# EAGLE board bontor_mbed_lowpan_rev_g (EAGLE 6.3), part 1 of 2
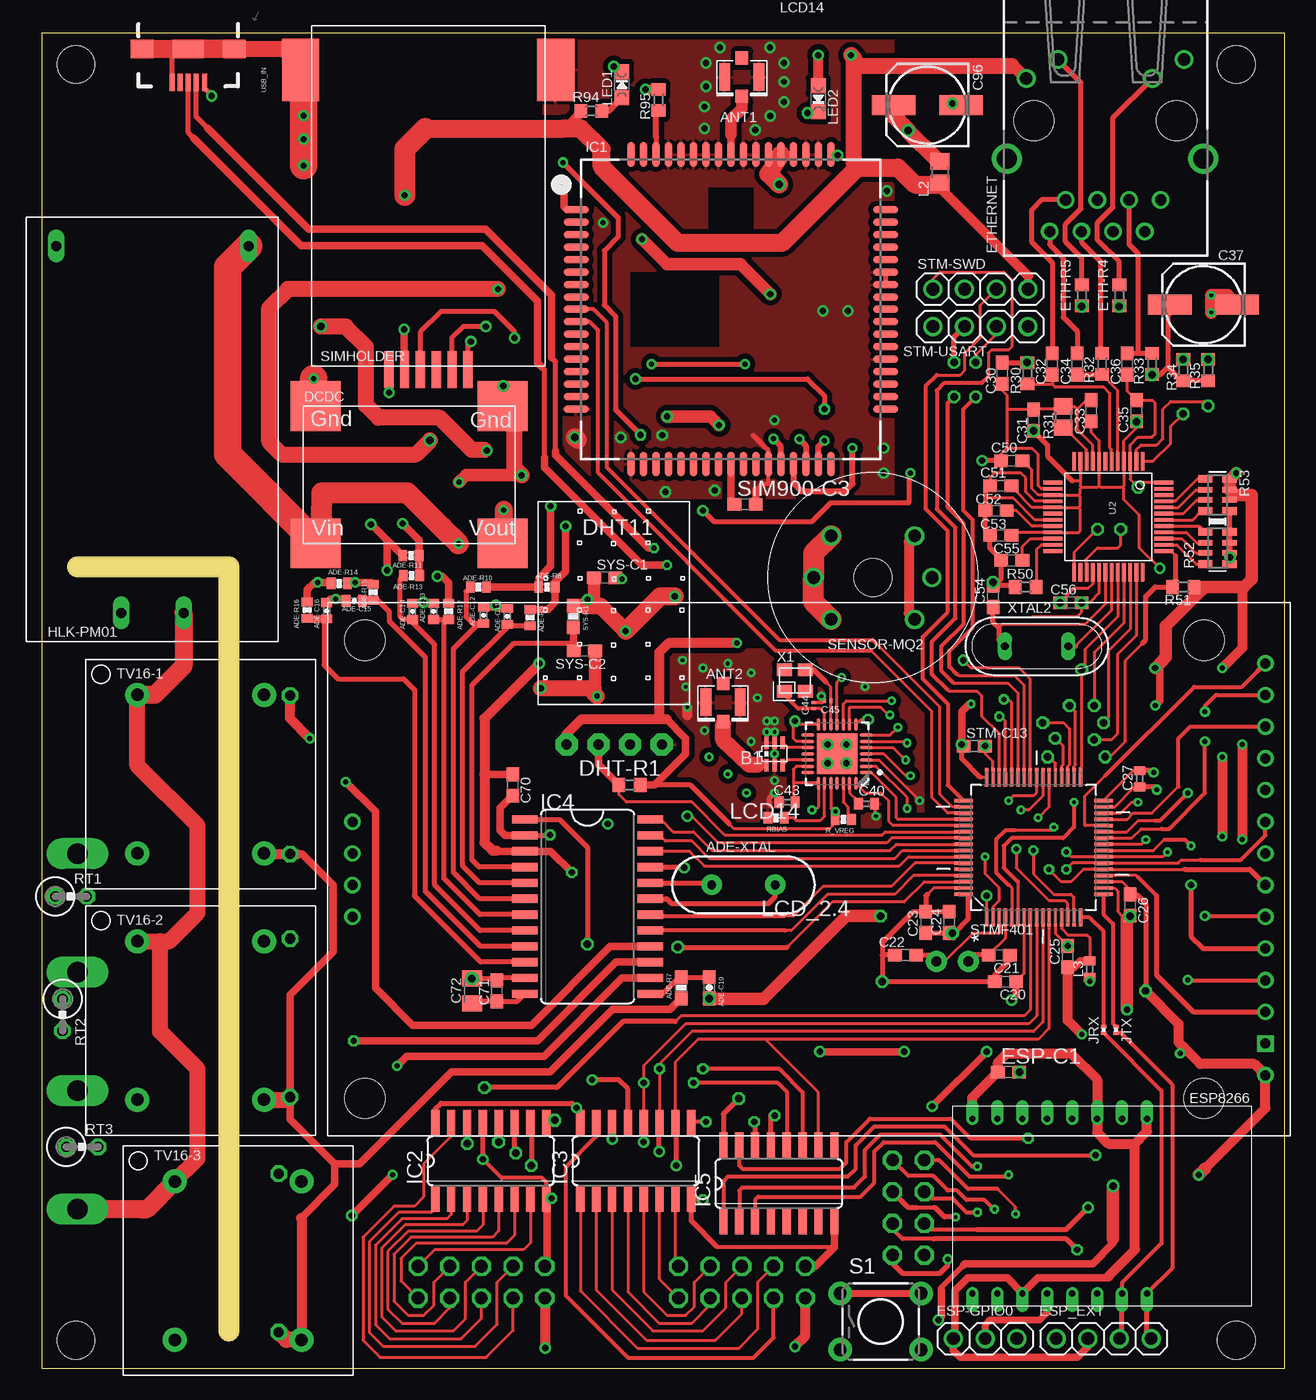
[diagram p2: board, top side]
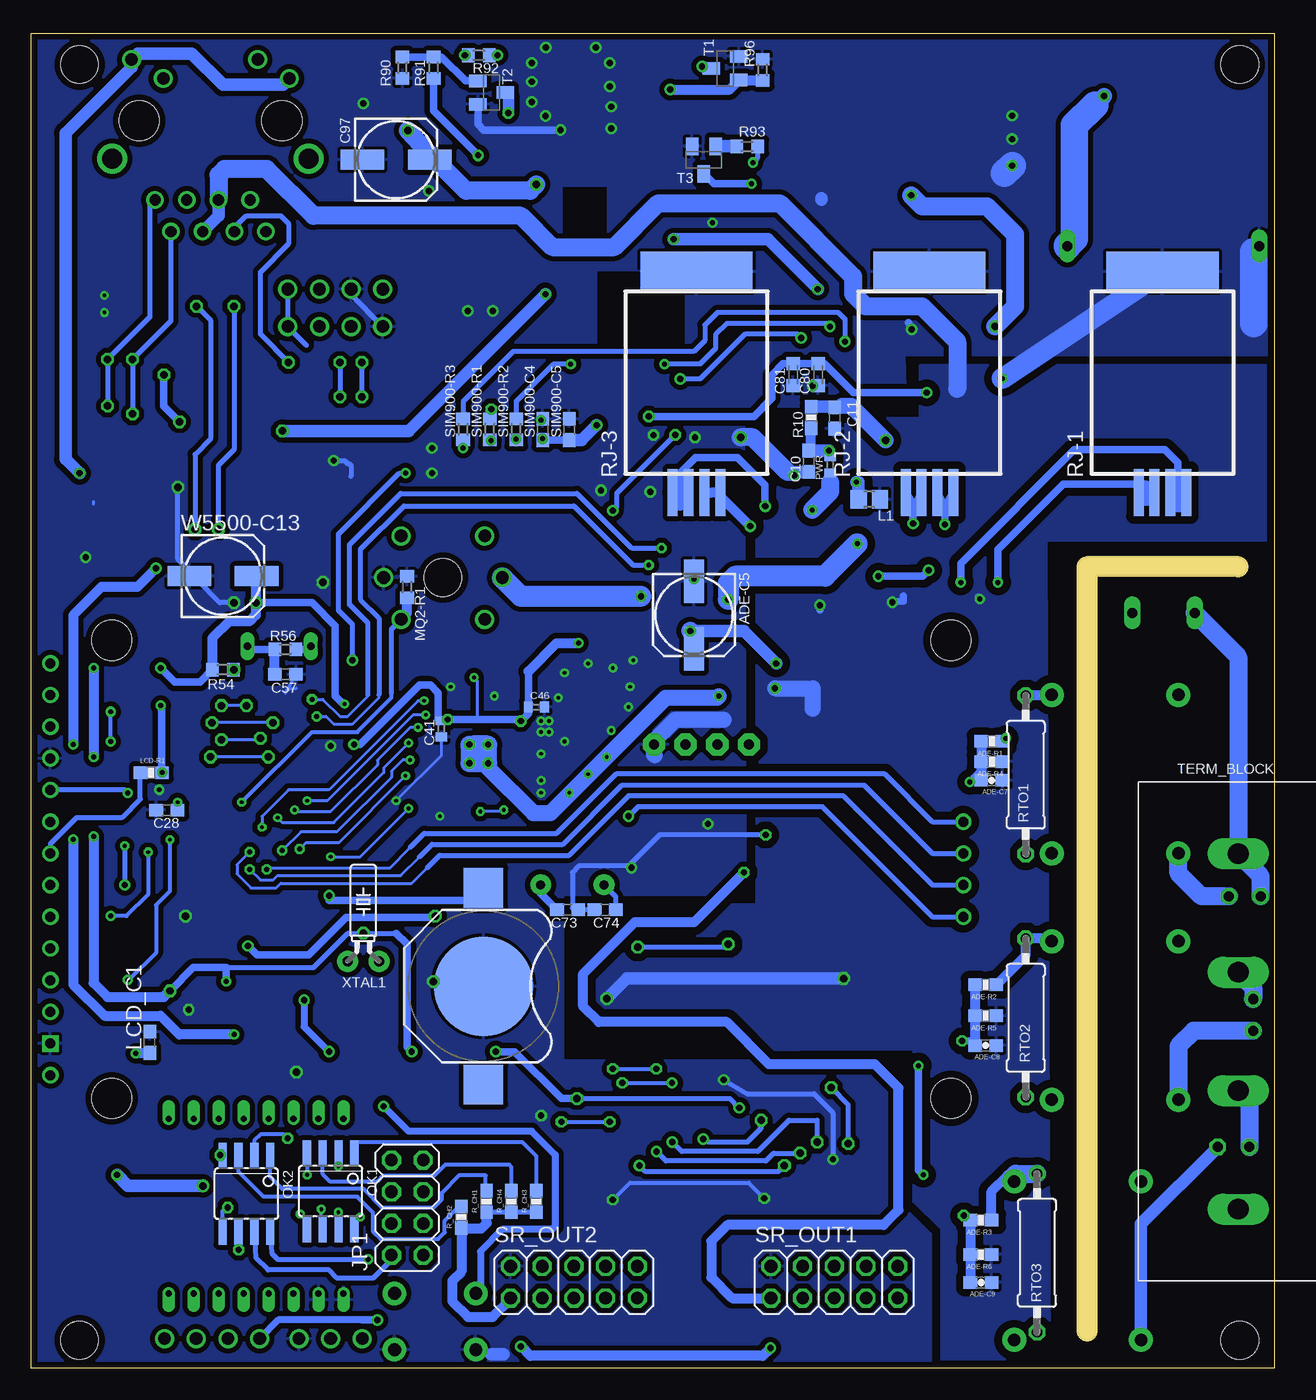
[diagram p3: board, bottom side, seen from below]

Size 99.62 x 107 mm. Coordinates in mm from the lower left corner, seen from the top.
Outline: 2.88,64.25 15,64.25 15,3
Outline: 99.62,0 99.62,107 0,107 0,0 99.62,0
Copper layers (1*16): Top 0.035mm / dielectric 1.5mm / Bottom 0.035mm
Design rules "default *": minimum track width 10mil, minimum drill 10mil, track to track 0.125mm, track to pad 0.125mm, pad to pad 0.125mm, via to via 0.125mm, smd to smd 0mil, copper to edge 0.5mm, drill to drill 0.2mm, minimum pad ring 10mil, minimum via ring 8mil, stop-mask expansion 4mil, vias tented up to drill 0mil, thermal gap 10mil
Net classes: 1 power: width 0.305 mm, drill 0.6 mm, clearance 0.254 mm; 2 gnd: width 0.254 mm, drill 0.6 mm, clearance 0.254 mm
Holes 3 mm at 2.75,2.25 95.75,2.25 2.75,104.5 95.75,104.5

## Footprints (pad centres in the part's own frame; a part is rotated, then mirrored left to right if it is on the bottom)
153CLV-0605 = smd 3.5 x 1.6: + 2.7,0; - -2.7,0
0603-CAP = smd 1.1 x 1: 1 -0.85,0; 2 0.85,0
0402-CAP = smd 0.7 x 0.9: 1 -0.65,0; 2 0.65,0
0603-RES = smd 1.1 x 1: 1 -0.85,0; 2 0.85,0
0402-RES = smd 0.7 x 0.9: 1 -0.65,0; 2 0.65,0
HC49US = drill 0.7 pad 1.651: 1 -2.54,0; 2 2.54,0
U.FL = smd 2.2 x 0.85: P$1 0,1.375; P$2 0,-1.375 | smd 1.05 x 1: P$3 1.525,0; P$4 -1.525,0
2450BM = smd 0.35 x 1: 1 0.65,0.9; 2 0,0.9; 3 -0.65,0.9; 4 -0.65,-0.9; 5 0,-0.9; 6 0.65,-0.9
BATTCON_12MM = smd 8 x 8: GND 0,0 | smd 3.175 x 3.175: PWR@1 -7.874,0; PWR@2 7.874,0
C0603 = smd 1.1 x 1: 1 -0.85,0; 2 0.85,0
C0402 = smd 0.7 x 0.9: 1 -0.65,0; 2 0.65,0
C0201 = smd 0.25 x 0.35: 1 -0.25,0; 2 0.25,0
C0805K = smd 1.3 x 1.6: 1 -1,0; 2 1,0
C0603K = smd 1.05 x 1.08: 1 -0.875,0; 2 0.875,0
DCDCMODULE-360 = smd 4 x 4: GND$1 -7.5,5.5; GND$2 7.5,5.5; VIN -7.5,-5.5; VOUT 7.5,-5.5
R0603 = smd 1 x 1.1: 1 -0.85,0; 2 0.85,0
WI12 = drill 0.5 pad 0.813 offset: ADC 10.4,1; CH_PD 12.4,1; GND 22.4,15; GPIO00 16.4,15; GPIO02 18.4,15; GPIO04 12.4,15; GPIO05 14.4,15; GPIO12 18.4,1; GPIO13 20.4,1; GPIO14 16.4,1; GPIO15 20.4,15; GPIO16 14.4,1; REST 8.4,1; RXD 10.4,15; TXD 8.4,15; VCC 22.4,1
1X03 = drill 1.016: 1 -2.54,0; 2 0,0; 3 2.54,0
PINHD4 = drill 1.016: 1 -3.81,0; 2 -1.27,0; 3 1.27,0; 4 3.81,0
RJ45_PULSEJACK = drill 0.9: 1 4.445,-6.35; 2 3.175,-8.89; 3 1.905,-6.35; 4 0.635,-8.89; 5 -0.635,-6.35; 6 -1.905,-8.89; 7 -3.175,-6.35; 8 -4.445,-8.89 | drill 1: 9 6.325,4.9; 10 3.785,3.38; 11 -3.785,4.9; 12 -6.325,3.38 | drill 1.6: P$5 -7.875,-3.05; P$6 7.875,-3.05 | hole 3.2: -5.715,0; 5.715,0
HLK-PM01 = drill 0.8 long: AC$1 -14.7,2.5; AC$2 -14.7,-2.5; GND 14.7,7.7; VOUT 14.7,-7.7
SIM900_SMT = smd 2 x 0.6: P$1 -12.4,8; P$2 -12.4,7; P$3 -12.4,6; P$4 -12.4,5; P$5 -12.4,4; P$6 -12.4,3; P$7 -12.4,2; P$8 -12.4,1; P$9 -12.4,0; P$10 -12.4,-1; P$11 -12.4,-2; P$12 -12.4,-3; P$13 -12.4,-4; P$14 -12.4,-5; P$15 -12.4,-6; P$16 -12.4,-7; P$17 -12.4,-8; P$35 12.4,-8; P$36 12.4,-7; P$37 12.4,-6; P$38 12.4,-5; P$39 12.4,-4; P$40 12.4,-3; P$41 12.4,-2; P$42 12.4,-1; P$43 12.4,0; P$44 12.4,1; P$45 12.4,2; P$46 12.4,3; P$47 12.4,4; P$48 12.4,5; P$49 12.4,6; P$50 12.4,7; P$51 12.4,8 | smd 0.6 x 2: P$18 -8,-12.4; P$19 -7,-12.4; P$20 -6,-12.4; P$21 -5,-12.4; P$22 -4,-12.4; P$23 -3,-12.4; P$24 -2,-12.4; P$25 -1,-12.4; P$26 0,-12.4; P$27 1,-12.4; P$28 2,-12.4; P$29 3,-12.4; P$30 4,-12.4; P$31 5,-12.4; P$32 6,-12.4; P$33 7,-12.4; P$34 8,-12.4; P$52 8,12.4; P$53 7,12.4; P$54 6,12.4; P$55 5,12.4; P$56 4,12.4; P$57 3,12.4; P$58 2,12.4; P$59 1,12.4; P$60 0,12.4; P$61 -1,12.4; P$62 -2,12.4; P$63 -3,12.4; P$64 -4,12.4; P$65 -5,12.4; P$66 -6,12.4; P$67 -7,12.4; P$68 -8,12.4
SO16 = smd 0.66 x 2.032: 1 -4.445,-3.073; 2 -3.175,-3.073; 3 -1.905,-3.073; 4 -0.635,-3.073; 5 0.635,-3.073; 6 1.905,-3.073; 7 3.175,-3.073; 8 4.445,-3.073; 9 4.445,3.073; 10 3.175,3.073; 11 1.905,3.073; 12 0.635,3.073; 13 -0.635,3.073; 14 -1.905,3.073; 15 -3.175,3.073; 16 -4.445,3.073
SOIC24 = smd 0.66 x 2.032: 1 -6.985,-5.029; 2 -5.715,-5.029; 3 -4.445,-5.029; 4 -3.175,-5.029; 5 -1.905,-5.029; 6 -0.635,-5.029; 7 0.635,-5.029; 8 1.905,-5.029; 9 3.175,-5.029; 10 4.445,-5.029; 11 5.715,-5.029; 12 6.985,-5.029; 13 6.985,5.029; 14 5.715,5.029; 15 4.445,5.029; 16 3.175,5.029; 17 1.905,5.029; 18 0.635,5.029; 19 -0.635,5.029; 20 -1.905,5.029; 21 -3.175,5.029; 22 -4.445,5.029; 23 -5.715,5.029; 24 -6.985,5.029
2X04 = drill 1.016 octagon: 1 -3.81,-1.27; 2 -3.81,1.27; 3 -1.27,-1.27; 4 -1.27,1.27; 5 1.27,-1.27; 6 1.27,1.27; 7 3.81,-1.27; 8 3.81,1.27
R0201 = smd 0.28 x 0.43: 1 -0.255,0; 2 0.255,0
FB805 = smd 1.3 x 1.5: 1 -0.85,0; 2 0.85,0
0402 = smd 0.7 x 0.9: 1 -0.65,0; 2 0.65,0
LCD_TOUCH_2-4 = drill 0.8: LCD_CS 36.59,-11.43; LCD_D/C 36.59,-6.35; LCD_MISO 36.59,3.81; LCD_MOSI 36.59,-3.81; LCD_RESET 36.59,-8.89; LCD_SCK 36.59,-1.27; LCD_VCC 36.59,-16.51; LED 36.59,1.27; SD_CS -36.59,-3.81; SD_MISO -36.59,1.27; SD_MOSI -36.59,-1.27; SD_SCK -36.59,3.81; T_CLK 36.59,6.35; T_CS 36.59,8.89; T_DIN 36.59,11.43; T_DO 36.59,13.97; T_IRQ 36.59,16.51 | drill 0.8 square: LCD_GND 36.59,-13.97 | hole 3.2: -35.59,18.36; -35.59,-18.36; 31.67,-18.36; 31.67,18.36
CHIPLED_0805_NOOUTLINE = smd 1.2 x 1.2: A 0,-1.05; C 0,1.05
SOIC08 = smd 0.66 x 2.032: 1 -1.905,-3.073; 2 -0.635,-3.073; 3 0.635,-3.073; 4 1.905,-3.073; 5 1.905,3.073; 6 0.635,3.073; 7 -0.635,3.073; 8 -1.905,3.073
R0402 = smd 0.7 x 0.9: 1 -0.65,0; 2 0.65,0
R0805 = smd 1.3 x 1.5: 1 -0.85,0; 2 0.85,0
RN8P-4R-CRA06S = smd 0.63 x 1.15: 1 -1.295,-0.975; 4 1.295,-0.975; 5 1.295,0.975; 8 -1.295,0.975 | smd 0.44 x 1.15: 2 -0.4,-0.975; 3 0.4,-0.975; 6 0.4,0.975; 7 -0.4,0.975
RJ11-4P-V = smd 0.8 x 3.8: P$1 -1.905,-8.81; P$2 -0.635,-8.81; P$3 0.635,-8.81; P$4 1.905,-8.81 | smd 9 x 3.2: SHIELD$1 0,8.9
0309V = drill 0.813 octagon: 1 -1.27,0; 2 1.27,0
0309_12 = drill 0.813 octagon: 1 -6.35,0; 2 6.35,0
TACTILE-PTH = drill 1.016 pad 1.88: 1 -3.251,2.261; 2 3.251,2.261; 3 -3.251,-2.261; 4 3.251,-2.261
MQ-3 = drill 1.016: A1 -3.35,3.35; A2 -3.35,-3.35; B1 3.35,3.35; B2 3.35,-3.35; HA -4.75,0; HB 4.75,0 | hole 3: 0,0
SIMHOLDER-PUSHPUSH = smd 3 x 5: SHIELD_GND$1 -10.24,9.2; SHIELD_GND$2 10.21,9.2 | smd 0.75 x 3: SIM_CLK 1.9,-14.83; SIM_GND -1.91,-14.83; SIM_IO 3.17,-14.83; SIM_RST -0.64,-14.83; SIM_VDD -3.18,-14.83; VPP 0.63,-14.83
2X05 = drill 1.016 octagon: 1 -5.08,-1.27; 2 -5.08,1.27; 3 -2.54,-1.27; 4 -2.54,1.27; 5 0,-1.27; 6 0,1.27; 7 2.54,-1.27; 8 2.54,1.27; 9 5.08,-1.27; 10 5.08,1.27
QFP50P1200X1200X160-64N = smd 1.473 x 0.279: 1 -5.613,3.759; 2 -5.613,3.251; 3 -5.613,2.743; 4 -5.613,2.261; 5 -5.613,1.753; 6 -5.613,1.245; 7 -5.613,0.762; 8 -5.613,0.254; 9 -5.613,-0.254; 10 -5.613,-0.762; 11 -5.613,-1.245; 12 -5.613,-1.753; 13 -5.613,-2.261; 14 -5.613,-2.743; 15 -5.613,-3.251; 16 -5.613,-3.759; 33 5.613,-3.759; 34 5.613,-3.251; 35 5.613,-2.743; 36 5.613,-2.261; 37 5.613,-1.753; 38 5.613,-1.245; 39 5.613,-0.762; 40 5.613,-0.254; 41 5.613,0.254; 42 5.613,0.762; 43 5.613,1.245; 44 5.613,1.753; 45 5.613,2.261; 46 5.613,2.743; 47 5.613,3.251; 48 5.613,3.759 | smd 0.279 x 1.473: 17 -3.759,-5.613; 18 -3.251,-5.613; 19 -2.743,-5.613; 20 -2.261,-5.613; 21 -1.753,-5.613; 22 -1.245,-5.613; 23 -0.762,-5.613; 24 -0.254,-5.613; 25 0.254,-5.613; 26 0.762,-5.613; 27 1.245,-5.613; 28 1.753,-5.613; 29 2.261,-5.613; 30 2.743,-5.613; 31 3.251,-5.613; 32 3.759,-5.613; 49 3.759,5.613; 50 3.251,5.613; 51 2.743,5.613; 52 2.261,5.613; 53 1.753,5.613; 54 1.245,5.613; 55 0.762,5.613; 56 0.254,5.613; 57 -0.254,5.613; 58 -0.762,5.613; 59 -1.245,5.613; 60 -1.753,5.613; 61 -2.261,5.613; 62 -2.743,5.613; 63 -3.251,5.613; 64 -3.759,5.613
SOT23-BEC = smd 1 x 1.4: B -0.95,-1.1; C 0,1.1; E 0.95,-1.1
TERMINAL-TWO-WAY = drill 1.65 long: PIN$1 0,14.25; PIN$2 0,4.75; PIN$3 0,-4.75; PIN$4 0,-14.25
TV16 = drill 1 pad 1.93: IA -5.08,-6.35; IB -5.08,6.35; OA 5.08,6.35; OB 5.08,-6.35
W5500 = smd 1.5 x 0.3: 1 -4.45,2.75; 2 -4.45,2.25; 3 -4.45,1.75; 4 -4.45,1.25; 5 -4.45,0.75; 6 -4.45,0.25; 7 -4.45,-0.25; 8 -4.45,-0.75; 9 -4.45,-1.25; 10 -4.45,-1.75; 11 -4.45,-2.25; 12 -4.45,-2.75; 25 4.45,-2.75; 26 4.45,-2.25; 27 4.45,-1.75; 28 4.45,-1.25; 29 4.45,-0.75; 30 4.45,-0.25; 31 4.45,0.25; 32 4.45,0.75; 33 4.45,1.25; 34 4.45,1.75; 35 4.45,2.25; 36 4.45,2.75 | smd 0.3 x 1.5: 13 -2.75,-4.45; 14 -2.25,-4.45; 15 -1.75,-4.45; 16 -1.25,-4.45; 17 -0.75,-4.45; 18 -0.25,-4.45; 19 0.25,-4.45; 20 0.75,-4.45; 21 1.25,-4.45; 22 1.75,-4.45; 23 2.25,-4.45; 24 2.75,-4.45; 37 2.75,4.45; 38 2.25,4.45; 39 1.75,4.45; 40 1.25,4.45; 41 0.75,4.45; 42 0.25,4.45; 43 -0.25,4.45; 44 -0.75,4.45; 45 -1.25,4.45; 46 -1.75,4.45; 47 -2.25,4.45; 48 -2.75,4.45
QFN50P500X500X100-29N = smd 1.05 x 0.3: 1 -2.35,1.5; 2 -2.35,1; 3 -2.35,0.5; 4 -2.35,0; 5 -2.35,-0.5; 6 -2.35,-1; 7 -2.35,-1.5; 15 2.35,-1.5; 16 2.35,-1; 17 2.35,-0.5; 18 2.35,0; 19 2.35,0.5; 20 2.35,1; 21 2.35,1.5 | smd 0.3 x 1.05: 8 -1.5,-2.35; 9 -1,-2.35; 10 -0.5,-2.35; 11 0,-2.35; 12 0.5,-2.35; 13 1,-2.35; 14 1.5,-2.35; 22 1.5,2.35; 23 1,2.35; 24 0.5,2.35; 25 0,2.35; 26 -0.5,2.35; 27 -1,2.35; 28 -1.5,2.35 | smd 3.25 x 3.25: 29 0,0
DHT11 = drill 0.8 pad 1.778 octagon: DATA -1.27,-11.43; GND 3.81,-11.43; NO 1.27,-11.43; VCC -3.81,-11.43
USB-B-MICRO-SMD_V03 = smd 1.4 x 0.4: D+1 2.7,0; D-1 2.7,0.65; GND1 2.7,-1.3; ID1 2.7,-0.65; VBUS1 2.7,1.3 | smd 1.5 x 1.8: SHIELD1 0,3.7; SHIELD2 0,-3.7 | smd 1.5 x 2.5: SHIELD3 0,0
NX2520SA = smd 1.2 x 1: 1 -0.85,-0.85; 2 0.85,-0.85; 3 0.85,0.85; 4 -0.85,0.85
TC26H = drill 0.813 pad 1.676: 1 -1.27,0; 2 1.27,0
QS = drill 0.61 long: 1 -2.54,0; 2 2.54,0

## Placement (x,y rotation side)
ADE-C5  10uF  [153CLV-0605]  46.5,60.38 270 bottom
ADE-C7  33nF  [0603-CAP]  22.62,47.12 0 bottom
ADE-C8  33nF  [0603-CAP]  23.12,25.88 0 bottom
ADE-C9  33nF  [0603-CAP]  23.5,6.88 0 bottom
ADE-C10  33nF  [0603-CAP]  53.5,30.5 270 top
ADE-C11  33nF  [0402-CAP]  37.33,60.27 90 top
ADE-C12  33nF  [0402-CAP]  35.42,60.38 90 top
ADE-C13  33nF  [0402-CAP]  31.43,60.67 90 top
ADE-C14  33nF  [0402-CAP]  29.73,60.67 90 top
ADE-C15  33nF  [0402-CAP]  25.05,61.52 180 top
ADE-C16  33nF  [0402-CAP]  22.85,60.73 90 top
ADE-R1  81K  [0603-RES]  22.62,50.25 180 bottom
ADE-R2  81K  [0603-RES]  23.12,30.75 180 bottom
ADE-R3  81K  [0603-RES]  23.5,11.88 180 bottom
ADE-R4  1K  [0603-RES]  22.62,48.62 180 bottom
ADE-R5  1K  [0603-RES]  23.12,28.25 180 bottom
ADE-R6  1K  [0603-RES]  23.5,9.12 180 bottom
ADE-R7  1K  [0603-RES]  51.25,30.5 90 top
ADE-R8  33R  [0402-RES]  40.5,62.62 0 top
ADE-R9  1K  [0402-RES]  39.15,60.17 270 top
ADE-R10  1K  [0402-RES]  35,62.62 180 top
ADE-R11  33R  [0402-RES]  29.6,65.15 180 top
ADE-R12  1K  [0402-RES]  32.62,60.67 270 top
ADE-R13  1K  [0402-RES]  29.65,63.55 180 top
ADE-R14  33R  [0402-RES]  23.85,62.91 0 top
ADE-R15  1K  [0402-RES]  26.57,62.2 270 top
ADE-R16  1K  [0402-RES]  21.27,60.76 270 top
ADE-XTAL  10MHz  [HC49US]  56.25,38.75 180 top
ANT1  U.FL  [U.FL]  56.12,103.5 270 top
ANT2  U.FL  [U.FL]  54.62,53.38 270 top
B1  2450BM15A0002  [2450BM]  58.75,49.25 180 top
BAT1  [BATTCON_12MM]  63.38,30.62 270 bottom
C10  0.1uF  [C0603]  37.31,72.7 270 bottom
C11  0.1uF  [C0603]  35.24,76.17 270 bottom
C20  100nF  [C0603]  77.25,31 180 top
C21  4.3pF  [C0603]  76.75,33.12 180 top
C22  4.3pF  [C0603]  69.25,33.12 0 top
C23  1uF  [C0603]  70.88,35.75 270 top
C24  100nF  [C0603]  72.75,35.75 90 top
C25  100nF  [C0603]  82.25,33 90 top
C26  100nF  [C0603]  87.25,37.12 270 top
C27  100nF  [C0402]  88,47.25 270 top
C28  4.7uF  [C0603]  88.75,44.75 180 bottom
C30  10nF  [C0603]  77,79.75 90 top
C31  100nF  [C0603]  79.5,76 90 top
C32  6.8nF  [C0603]  81,80.5 270 top
C33  100nF  [C0603]  84.12,76.75 90 top
C34  6.8nF  [C0603]  83,80.5 270 top
C35  100nF  [C0603]  87.75,76.75 90 top
C36  22nF  [C0603]  87,80.5 90 top
C37  10uF/16V  [153CLV-0605]  93.12,85.25 180 top
C40  100nF  [C0402]  66.12,45.25 0 top
C41  100nF  [C0402]  66.75,51.25 270 bottom
C43  100nF  [C0402]  59.75,45.38 180 top
C44  27p  [C0201]  61.88,53.12 90 top
C45  27p  [C0201]  63,53.5 180 top
C46  100nF  [C0402]  59.12,53 0 bottom
C50  100nF  [C0603]  77.75,72.75 180 top
C51  100nF  [C0603]  76.88,70.75 180 top
C52  4.7uF  [C0603]  76.5,68.75 180 top
C53  100nF  [C0603]  76.88,66.75 180 top
C54  18pF  [C0603]  76.25,61.88 90 top
C55  10nF  [C0603]  77.75,64.75 180 top
C56  100nF  [C0603]  82.5,61.38 0 top
C57  18pF  [C0603]  79.25,55.62 0 bottom
C70  100nF  [C0603]  37.75,46.75 270 top
C71  0.1uF  [C0603]  36.5,30.25 90 top
C72  10uF  [C0805K]  34.5,30.25 90 top
C73  22pF  [C0603]  56.62,36.75 0 bottom
C74  22pF  [C0603]  53.62,36.75 180 bottom
C80  100nF  [C0603K]  36.55,79.65 90 bottom
C81  22pF  [C0603K]  38.55,79.65 90 bottom
C96  100uF  [153CLV-0605]  71,101.25 180 top
C97  100uF  [153CLV-0605]  70.38,96.88 0 bottom
DCDC  DCDCMODULE_360  [DCDCMODULE-360]  29.45,71.62 0 top
DHT-R1  10k  [R0603]  47.12,46.75 180 top
ESP  ESP  [WI12]  97,21 180 top
ESP-C1  100nF  [C0603]  77.5,23.75 0 top
ESP-GPIO0  [1X03]  75.62,2.38 0 top
ESP_EXT  PINHD4  [PINHD4]  85.12,2.38 0 top
ETH-R4  330  [R0603]  86.38,86 90 top
ETH-R5  330  [R0603]  83.38,86 90 top
ETHERNET  [RJ45_PULSEJACK]  85.25,100 0 top
HLK-PM01  HLK-PM01  [HLK-PM01]  8.88,75.25 90 top
IC1  SIM900  [SIM900_SMT]  55.25,84.88 0 top
IC2  74HC595D  [SO16]  36,16.62 0 top
IC3  74HC595D  [SO16]  47.62,16.62 0 top
IC4  ADE7758RW  [SOIC24]  43.75,37 270 top
IC5  74HC595D  [SO16]  59.09,14.81 0 top
JP1  [2X04]  69.47,12.88 90 bottom
JRX  0  [R0201]  85.12,27.12 90 top
JTX  0  [R0201]  86.12,27.12 90 top
L1  150Mhz  [FB805]  32.45,69.65 180 bottom
L2  150Mhz  [FB805]  72,95.88 270 top
L3  BLM15HB121SN1  [0402]  84,32 90 top
LCD14  LCD_2.4  [LCD_TOUCH_2-4]  61.5,40 0 top
LCD-R1  680R  [0603-RES]  90,47.75 0 bottom
LCD_C1  100nF  [C0603]  90.12,26.12 90 bottom
LED1  [CHIPLED_0805_NOOUTLINE]  46.5,102.88 0 top
LED2  [CHIPLED_0805_NOOUTLINE]  62.25,101.75 180 top
MQ2-R1  10k  [R0603]  69.5,62.62 270 bottom
OK1  ILD205  [SOIC08]  75.62,14.2 180 bottom
OK2  ILD205  [SOIC08]  82.38,14 180 bottom
PWR  [R0402]  35.59,72.41 270 bottom
R10  10R  [0603-RES]  37.11,76.21 90 bottom
R30  49R9  [R0603]  79,79.75 270 top
R31  12K4  [R0805]  81.88,76.25 270 top
R32  49R9  [R0603]  85,80.5 90 top
R33  10R  [R0603]  89,80.5 270 top
R34  49R9  [R0603]  91.5,80 270 top
R35  49R9  [R0603]  93.5,80 270 top
R50  10k  [R0603]  78.88,62.62 0 top
R51  10k  [R0603]  91.5,62.62 180 top
R52  10k  [RN8P-4R-CRA06S]  94.25,65.75 270 top
R53  10k  [RN8P-4R-CRA06S]  94.25,70 90 top
R54  10k  [R0603]  84.25,56 180 bottom
R56  1M  [R0603]  79.25,57.62 180 bottom
R90  10K  [R0603]  69.88,104.25 270 bottom
R91  1K  [R0603]  67.38,104.25 270 bottom
R92  680R  [R0603]  63.75,105.25 180 bottom
R93  120R  [R0603]  42.24,97.92 180 bottom
R94  680R  [R0603]  44.05,100.78 180 top
R95  1K  [R0603]  49.45,101.65 270 top
R96  10K  [R0603]  41,104.08 90 bottom
R_CH1  270  [0603-RES]  63.12,13.38 90 bottom
R_CH2  270  [0603-RES]  65.14,12.11 90 bottom
R_CH3  270  [0603-RES]  59.12,13.38 90 bottom
R_CH4  270  [0603-RES]  61.12,13.38 90 bottom
R_VREG  10K  [0402-RES]  64.25,44 180 top
RBIAS  56k  [0402-RES]  58.88,44.12 180 top
RJ-1  RJ11-4P-V  [RJ11-4P-V]  8.95,79 0 bottom
RJ-2  RJ11-4P-V  [RJ11-4P-V]  27.62,79 0 bottom
RJ-3  RJ11-4P-V  [RJ11-4P-V]  46.3,79 0 bottom
RT1  [0309V]  2.35,37.83 0 top
RT2  [0309V]  1.68,28.32 270 top
RT3  [0309V]  3.25,17.75 0 top
RTO1  [0309_12]  19.91,47.58 90 bottom
RTO2  [0309_12]  19.91,28.09 90 bottom
RTO3  [0309_12]  19,9.25 90 bottom
S1  [TACTILE-PTH]  67.25,3.75 0 top
SENSOR-MQ2  METHANE_SENSOR  [MQ-3]  66.62,63.38 0 top
SIM900-C3  4u7  [C0603]  56.38,69.25 0 top
SIM900-C4  100nF  [C0603]  58.62,75.25 90 bottom
SIM900-C5  22pF  [C0603]  56.5,75.25 90 bottom
SIM900-R1  22R  [R0603]  62.88,75.25 90 bottom
SIM900-R2  22R  [R0603]  60.75,75.25 90 bottom
SIM900-R3  22R  [R0603]  65,75.25 90 bottom
SIMHOLDER  SIM_HOLDER  [SIMHOLDER-PUSHPUSH]  31,94.88 0 top
SR_OUT1  [2X05]  35.25,6.9 0 bottom
SR_OUT2  [2X05]  56.12,6.9 0 bottom
STM-C13  100nF  [C0603]  74.75,49.88 0 top
STM-SWD  PINHD4  [PINHD4]  75.25,86.5 180 top
STM-USART  PINHD4  [PINHD4]  75.25,83.5 180 top
STMF401  STM32F103RBT6  [QFP50P1200X1200X160-64N]  79.5,41.75 90 top
SYS-C1  0.1uF  [C0603]  45.12,63.38 0 top
SYS-C2  0.1uF  [C0603]  43.5,57.5 0 top
SYS-R1  10R  [0603-RES]  42.62,60.25 270 top
T1  [SOT23-BEC]  44,104.2 90 bottom
T2  [SOT23-BEC]  62.73,102.25 270 bottom
T3  [SOT23-BEC]  45.7,96.84 180 bottom
TERM_BLOCK  TERMINAL_BLOCK_TW  [TERMINAL-TWO-WAY]  2.88,27 0 bottom
TV16-1  TRANSFORMER  [TV16]  12.75,47.62 0 top
TV16-2  TRANSFORMER  [TV16]  12.75,27.88 0 top
TV16-3  TRANSFORMER  [TV16]  15.75,8.62 0 top
U2  W5500  [W5500]  85.5,68.25 270 top
U$4  CC2520  [QFN50P500X500X100-29N]  63.75,49.25 180 top
U$17  [DHT11]  45.9,61.44 0 top
USB_IN  USB_MICROB  [USB-B-MICRO-SMD_V03]  11.75,105.75 270 top
W5500-C13  10uF/16V  [153CLV-0605]  84.25,63.5 0 bottom
X1  NX2520SA  [NX2520SA]  60.38,55.12 0 top
XTAL1  32.768kHz  [TC26H]  73,32.62 0 bottom
XTAL2  25MHz  [QS]  79.75,57.88 0 top